# EAGLE design Internal_Breakout (EAGLE 9.0.0)
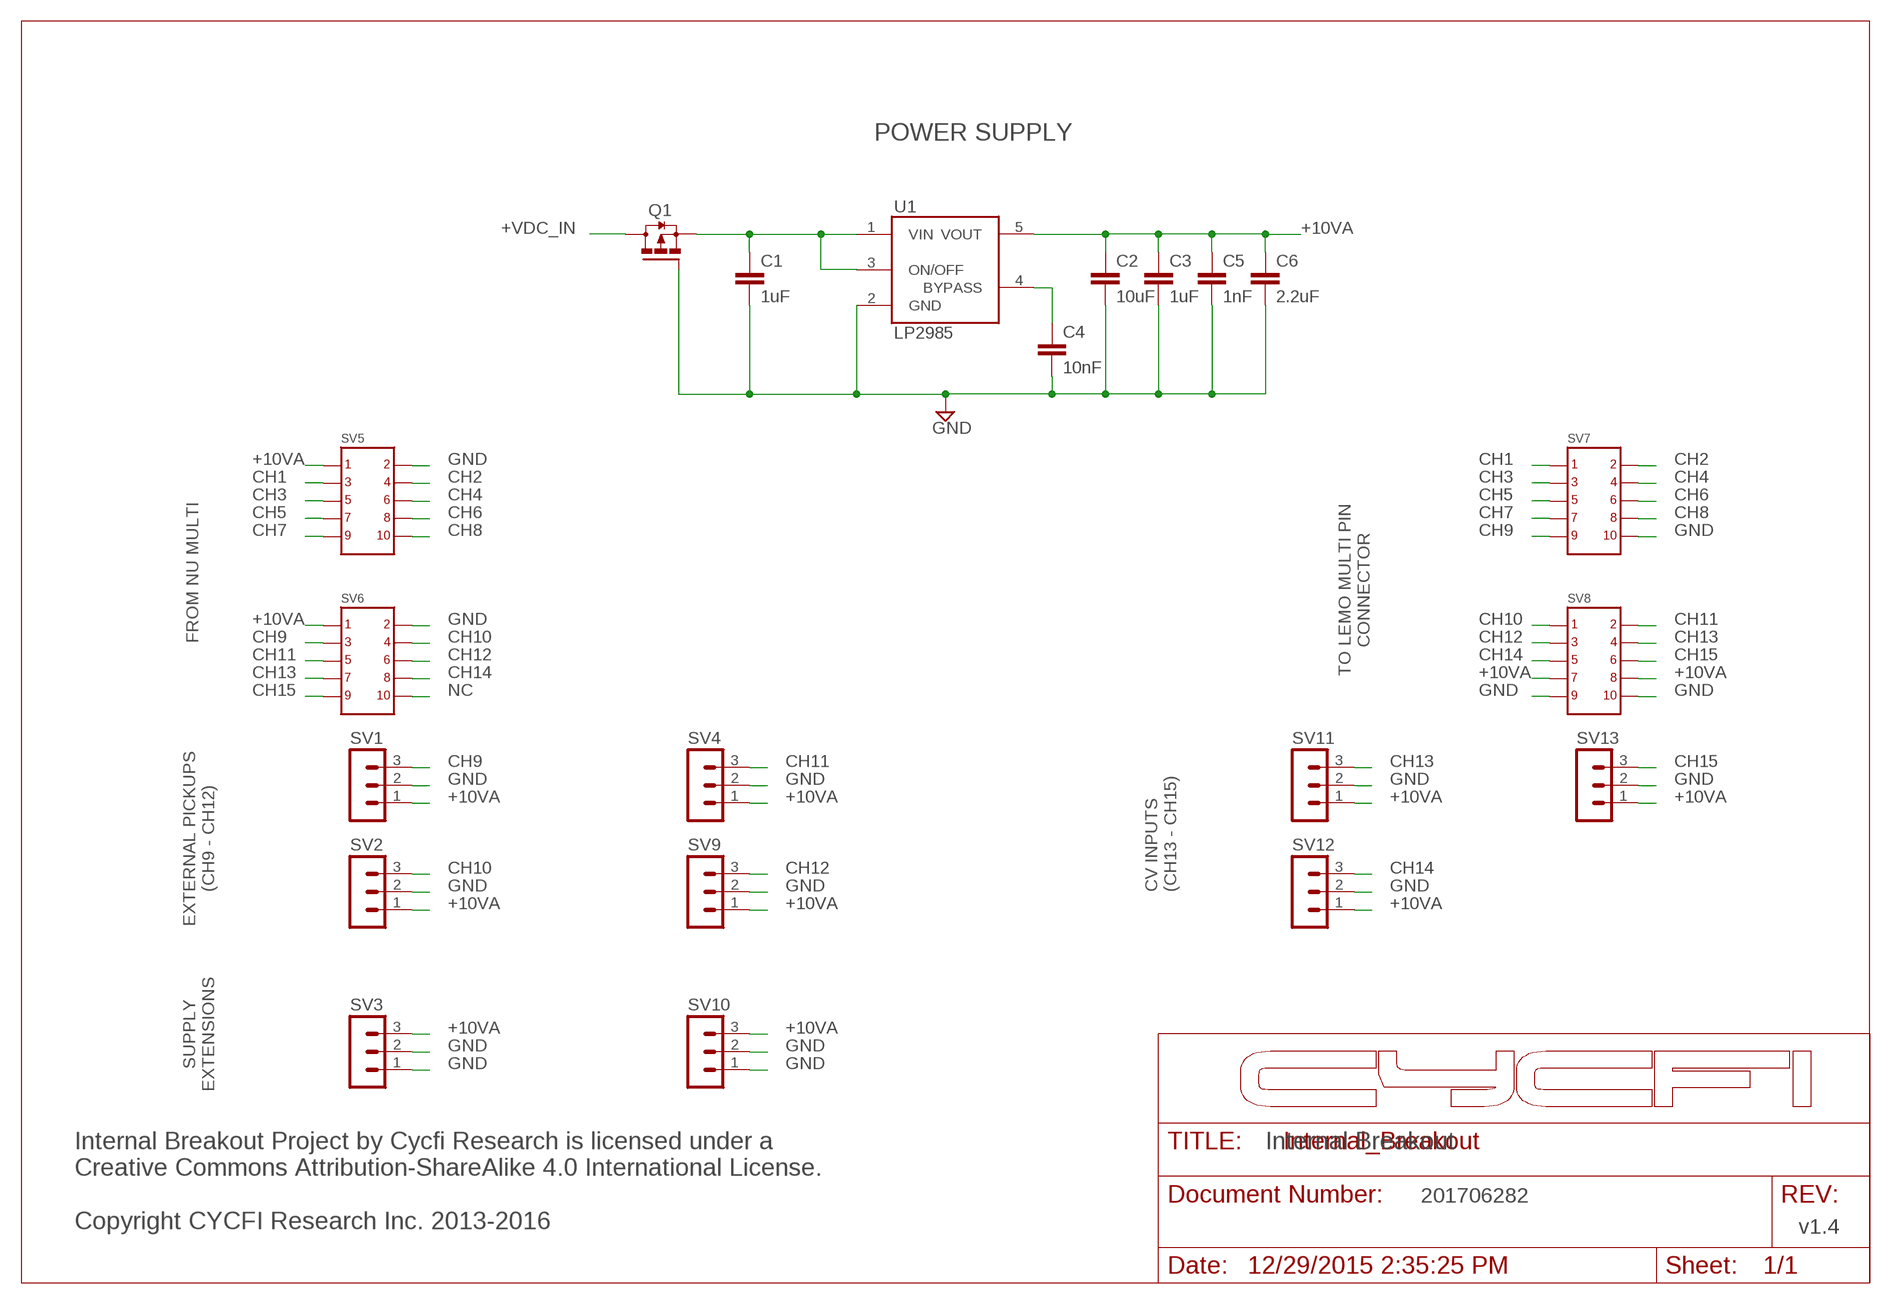
[diagram p0: schematic, sheet 1]

## Parts
C1  1uF  C-EUC0603  [C0603]
C2  10uF  C-EUC0603  [C0603]
C3  1uF  C-EUC0603  [C0603]
C4  10nF  C-EUC0402  [C0402]
C5  1nF  C-EUC0402  [C0402]
C6  2.2uF  C-EUC0603  [C0603]
Q1  DMP3099L  FDN360P  [SUPER-SOT3]
SV1  MA03-1  [MA03-1]
SV2  MA03-1  [MA03-1]
SV3  MA03-1  [MA03-1]
SV4  MA03-1  [MA03-1]
SV5  2X5  [2X5]
SV6  2X5  [2X5]
SV7  2X5  [2X5]
SV8  2X5  [2X5]
SV9  MA03-1  [MA03-1]
SV10  MA03-1  [MA03-1]
SV11  MA03-1  [MA03-1]
SV12  MA03-1  [MA03-1]
SV13  MA03-1  [MA03-1]
U1  LP2985  LP2985AIM5-3.3  [SOT25]

## Nets
+VDC_IN: Q1.3(D) SV8.7 SV8.8
BYPASS: C4.1 U1.4(BYPASS)
CH1: SV5.3 SV7.1
CH2: SV5.4 SV7.2
CH3: SV5.5 SV7.3
CH4: SV5.6 SV7.4
CH5: SV5.7 SV7.5
CH6: SV5.8 SV7.6
CH7: SV5.9 SV7.7
CH8: SV5.10 SV7.8
CH9: SV1.3 SV6.3 SV7.9
CH10: SV2.3 SV6.4 SV8.1
CH11: SV4.3 SV6.5 SV8.2
CH12: SV6.6 SV8.3 SV9.3
CH13: SV6.7 SV8.4 SV11.3
CH14: SV6.8 SV8.5 SV12.3
CH15: SV6.9 SV8.6 SV13.3
GND: C1.2 C2.2 C3.2 C4.2 C5.2 C6.2 Q1.1(G) SV1.2 SV2.2 SV3.1 SV3.2 SV4.2 SV5.2 SV6.2 SV7.10 SV8.9 SV8.10 SV9.2 SV10.1 SV10.2 SV11.2 SV12.2 SV13.2 U1.2(GND)
N$1: C1.1 Q1.2(S) U1.1(VIN) U1.3(ON/OFF)
N$2: SV6.10
V+: C2.1 C3.1 C5.1 C6.1 SV1.1 SV2.1 SV3.3 SV4.1 SV5.1 SV6.1 SV9.1 SV10.3 SV11.1 SV12.1 SV13.1 U1.5(VOUT)

## Notes on the sheet
- POWER SUPPLY
- +10VA
- +10VA | GND
- CH1 | CH2
- CH3 | CH4
- CH5 | CH6
- CH7 | CH8
- TO LEMO MULTI PIN
  CONNECTOR
- +10VA | GND
- FROM NU MULTI
- +10VA | +10VA
- NC
- +10VA | +10VA | +10VA | +10VA
- EXTERNAL PICKUPS
  (CH9 - CH12)
- CV INPUTS
  (CH13 - CH15)
- +10VA | +10VA | +10VA
- SUPPLY
  EXTENSIONS
- +10VA | +10VA
- Internal Breakout
- 201706282
- Internal Breakout Project by Cycfi Research is licensed under a 
  Creative Commons Attribution-ShareAlike 4.0 International License. 
  
  Copyright CYCFI Research Inc. 2013-2016
- v1.4
- 12/29/2015 2:35:25 PM

## Library data of the parts
C1-C6 = rcl:C-EU: CAPACITOR, European symbol; SPICEPREFIX: C
Q1 = transistor-power:FDN360P: Single P-Channel, PowerTrench (R) MOSFET Source: http://www.fairchildsemi.com/ds/FD/FDN360P.pdf
SV1-SV4 SV9-SV13 = con-lstb:MA03-1: PIN HEADER; OC_FARNELL: unknown; OC_NEWARK: unknown
SV5-SV8 = headers(2mm):2X5
U1 = LP2985:LP2985: LP2985-N Micropower 150 mA Low-Noise Ultra Low-Dropout Regulator

## Board
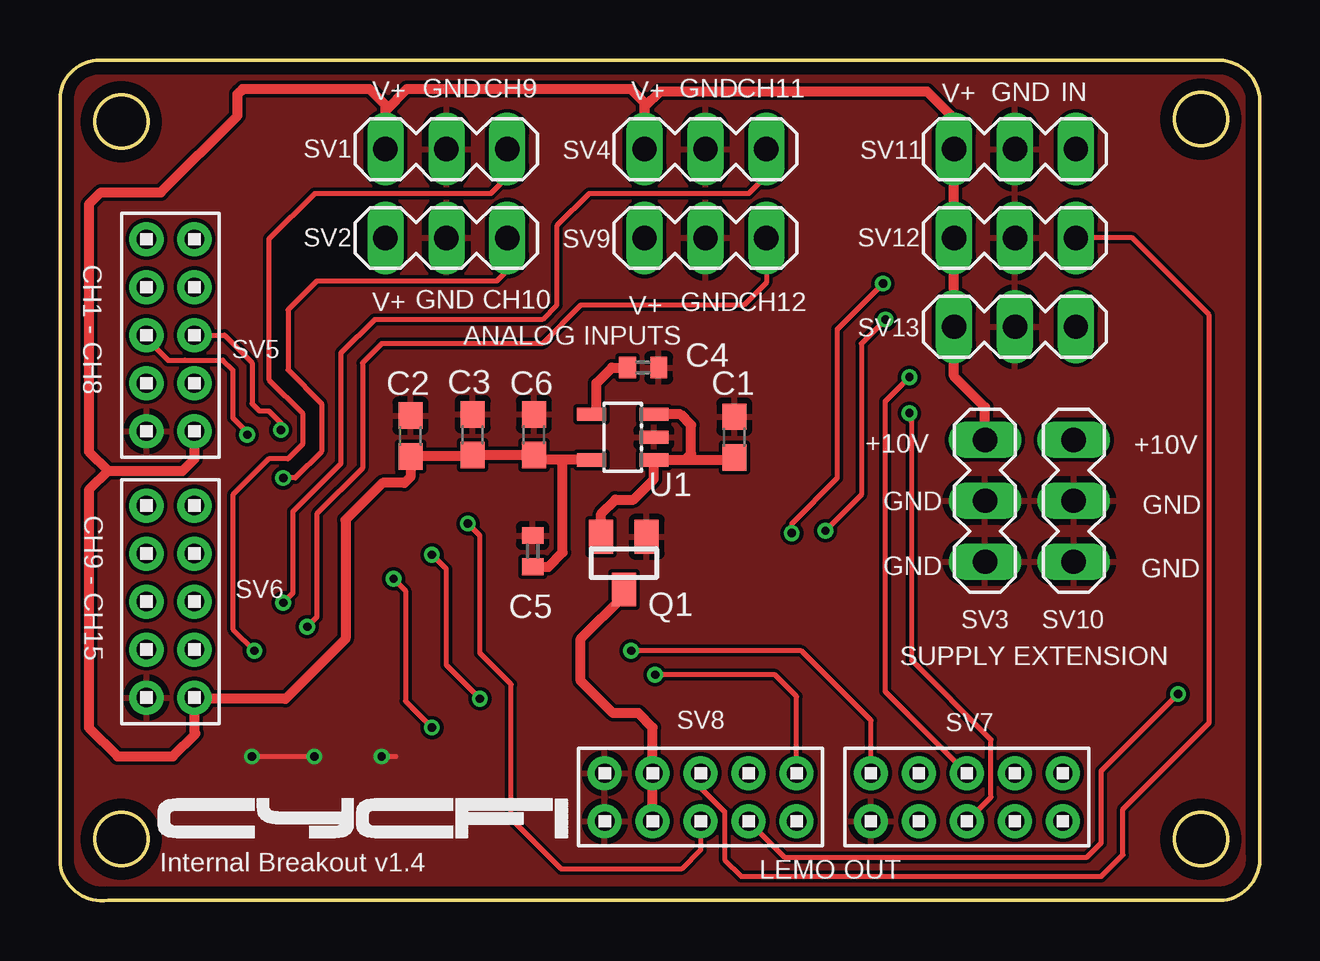
[diagram p1: board, top side]
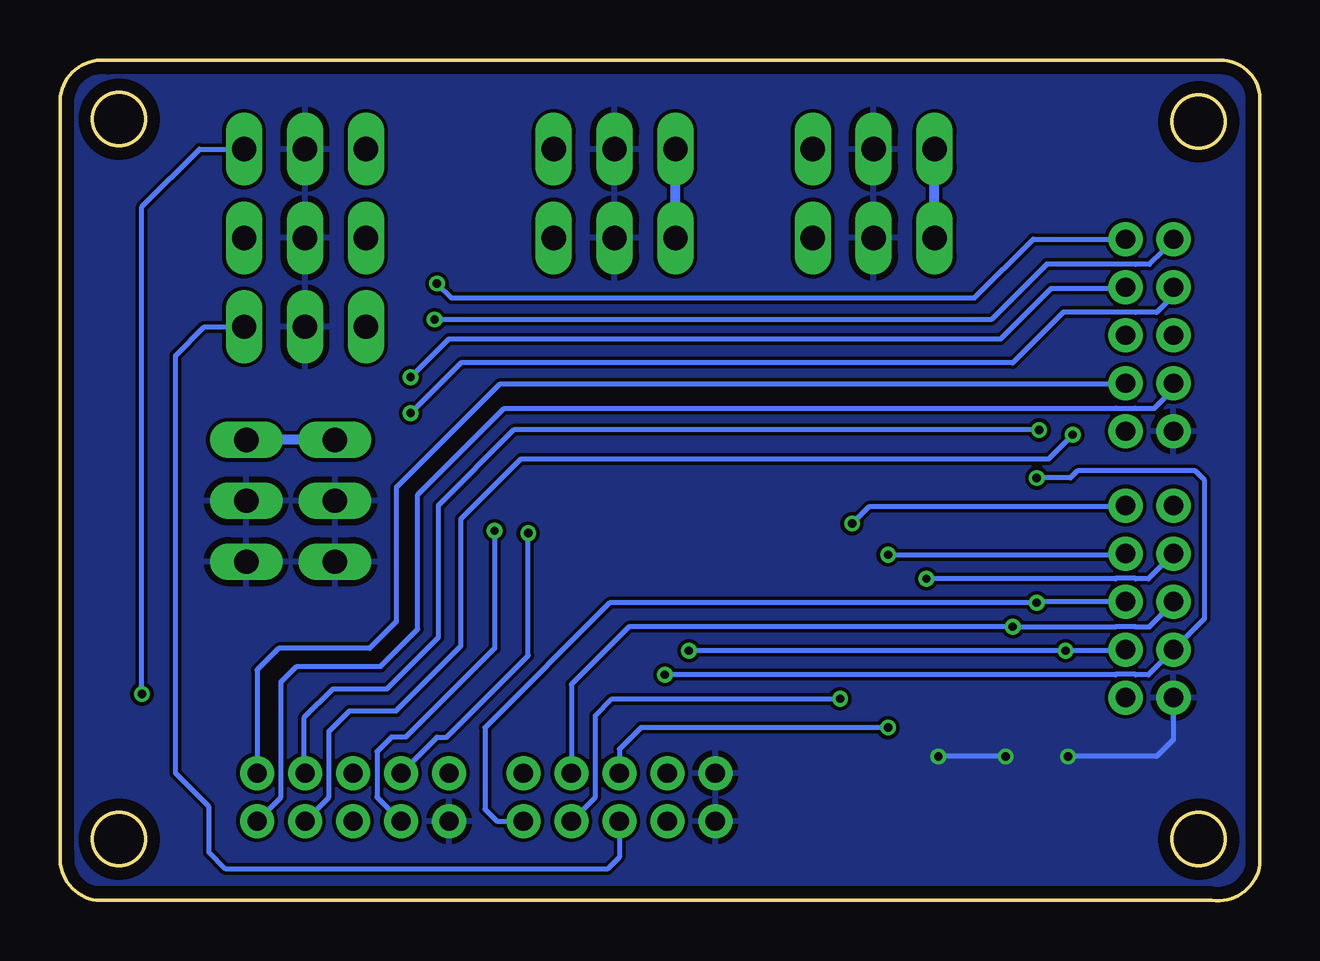
[diagram p2: board, bottom side, seen from below]

Size 50.02 x 35.03 mm. Coordinates in mm from the lower left corner, seen from the top.
Outline: 1.5,35.02 48,35.02 arc-90 50,33.52 50,2.02 arc-90 48.5,0.02 2,0.02 arc-90 0,1.52 0,33.27 arc-90 1.5,35.02
Outline: circle at 2.55,32.47 radius 1.1
Outline: circle at 2.55,2.57 radius 1.1
Outline: circle at 47.55,32.57 radius 1.1
Outline: circle at 47.55,2.57 radius 1.1
Copper layers (1*16): Top 0.035mm / dielectric 1.6mm / Bottom 0.035mm
Design rules "Elecrow_2-layer_PCB_eagle_rule": minimum track width 6mil, minimum drill 12mil, track to track 6mil, track to pad 6mil, pad to pad 6mil, via to via 8mil, smd to smd 0mil, copper to edge 20mil, drill to drill 10mil, minimum pad ring 6mil, minimum via ring 6mil, stop-mask expansion 0mil, vias tented up to drill 100mil, thermal gap 10mil

### Footprints (pad centres in the part's own frame; a part is rotated, then mirrored left to right if it is on the bottom)
C0603 = smd 1.1 x 1: 1 -0.85,0; 2 0.85,0
C0402 = smd 0.7 x 0.9: 1 -0.65,0; 2 0.65,0
SUPER-SOT3 = smd 1 x 1.4: 1 -0.95,-1.1; 2 0.95,-1.1; 3 0,1.1
MA03-1 = drill 1.016 long: 1 -2.54,0; 2 0,0; 3 2.54,0
2X5 = drill 0.8 pad 1.422: 1 -4,-1; 2 -4,1; 3 -2,-1; 4 -2,1; 5 0,-1; 6 0,1; 7 2,-1; 8 2,1; 9 4,-1; 10 4,1
SOT25 = smd 0.55 x 1.2: 1 -0.95,-1.3; 2 0,-1.3; 3 0.95,-1.3; 4 0.95,1.3; 5 -0.95,1.3

### Placement (x,y rotation side)
C1  28.1,19.32 90 top
C2  14.6,19.37 90 top
C3  17.2,19.42 90 top
C4  24.3,22.22 0 top
C5  19.7,14.57 90 top
C6  19.75,19.42 90 top
Q1  23.5,14.07 180 top
SV1  16.1,31.32 0 top
SV2  16.1,27.62 0 top
SV3  38.55,16.67 90 top
SV4  26.9,31.32 0 top
SV5  4.6,23.57 90 top
SV6  4.6,12.47 90 top
SV7  37.8,4.32 180 top
SV8  26.7,4.32 180 top
SV9  26.9,27.62 0 top
SV10  42.25,16.67 90 top
SV11  39.8,31.32 0 top
SV12  39.8,27.62 0 top
SV13  39.8,23.92 0 top
U1  23.45,19.32 90 top

### Tracks (layer width: path | path; a pad name or v marks a point on that pad's centre or on a via)
+VDC_IN
  Top 0.406: SV8.8 SV8.7 24.7,7.22 24.1,7.82 23.05,7.82 21.7,9.17 21.7,10.92 23.5,12.72 Q1.3
BYPASS
  Top 0.406: U1.4 22.35,20.47 22.35,21.57 23,22.22 C4.1
CH1
  Bottom 0.203: SV5.3 5.65,21.52 31.7,21.52 36,17.22 36,11.62 37.1,10.52 40.9,10.52 41.8,9.62 SV7.1
CH2
  Bottom 0.203: SV7.2 40.8,4.32 40.8,9.12 40.15,9.77 36.65,9.77 35.1,11.32 35.1,16.92 31.5,20.52 6.02,20.52 6,20.53 5.2,20.53 5.19,20.52 4.4,20.52 3.6,21.32 SV5.4
CH3  (via drill 0.35)
  Top 0.203: SV5.5 6.85,23.57 8,22.42 8,20.72 8.3,20.42 8.7,20.42 9.2,19.92 v9.2,19.62
  Bottom 0.203: v9.2,19.62 31.1,19.62 34.25,16.47 34.25,10.97 36.4,8.82 38.65,8.82 39.85,7.62 39.85,5.37 SV7.3
CH4  (via drill 0.35)
  Top 0.203: SV5.6 3.6,23.42 4.5,22.52 5.19,22.52 5.2,22.53 6.79,22.53 7.2,22.12 7.2,20.12 7.8,19.52 v7.8,19.42
  Bottom 0.203: SV7.4 38.8,4.32 38.8,7.07 37.95,7.92 36,7.92 33.3,10.62 33.3,15.92 30.8,18.42 8.8,18.42 v7.8,19.42
CH5  (via drill 0.35)
  Top 0.203: SV7.5 34.4,8.72 34.4,20.82 v35.4,21.82
  Bottom 0.203: v35.4,21.82 33.8,23.42 10.8,23.42 8.7,25.52 5.65,25.52 SV5.7
CH6  (via drill 0.35)
  Top 0.203: SV7.6 38.8,4.32 38.8,6.72 35.5,10.02 35.5,19.97 35.4,20.07 v35.4,20.32
  Bottom 0.203: SV5.8 3.6,25.22 4.3,24.52 5.19,24.52 5.2,24.53 8.19,24.53 10.3,22.42 33.3,22.42 v35.4,20.32
CH7  (via drill 0.35)
  Top 0.203: v30.5,15.32 30.5,15.72 32.4,17.62 32.4,23.82 v34.3,25.72
  Bottom 0.203: SV7.7 34.3,6.82 33.9,6.82 30.5,10.22 v30.5,15.32 | v34.3,25.72 33.7,25.12 11.9,25.12 9.45,27.57 SV5.9
CH8  (via drill 0.35)
  Top 0.203: v34.4,24.22 33.4,23.22 33.4,16.92 v31.9,15.42
  Bottom 0.203: SV5.10 4.05,27.12 4.05,27.07 4.6,26.52 5.19,26.52 5.2,26.53 8.89,26.53 11.2,24.22 v34.4,24.22 | v31.9,15.42 31.9,10.52 35.6,6.82 36.2,6.82 36.8,6.22 36.8,4.32 SV7.8
CH9  (via drill 0.35)
  Top 0.203: SV7.9 33.8,7.52 30.9,10.42 v23.8,10.42 | SV1.3 18.64,30.16 17.95,29.47 10.6,29.47 8.7,27.57 8.7,21.72 10.1,20.32 10.1,19.02 9.5,18.42 8.7,18.42 7.2,16.92 7.2,11.32 v8.1,10.42
  Bottom 0.203: SV6.3 5.65,10.42 v8.1,10.42 v23.8,10.42
CH10  (via drill 0.35)
  Top 0.203: SV8.1 30.7,8.52 29.8,9.42 v24.8,9.42 | SV2.3 18.64,26.26 18.2,25.82 10.7,25.82 9.5,24.62 9.5,22.12 10.9,20.72 10.9,18.72 9.8,17.62 v9.3,17.62
  Bottom 0.203: v24.8,9.42 6.02,9.42 6,9.43 5.2,9.43 5.19,9.42 4.65,9.42 SV6.4 2.3,11.77 2.3,17.52 2.7,17.92 7.6,17.92 7.9,17.62 v9.3,17.62
CH11  (via drill 0.35)
  Top 0.203: SV4.3 29.44,30.21 28.7,29.47 22.05,29.47 20.7,28.12 20.7,24.82 20.1,24.22 13.1,24.22 11.7,22.82 11.7,18.22 9.7,16.22 9.7,12.82 v9.3,12.42
  Bottom 0.203: SV6.5 9.25,12.47 v9.3,12.42 27.1,12.42 32.3,7.22 32.3,3.82 31.8,3.32 SV8.2
CH12  (via drill 0.35)
  Top 0.203: SV9.3 29.44,25.76 28.5,24.82 21.7,24.82 20.1,23.22 13.4,23.22 12.6,22.42 12.6,18.02 10.7,16.12 10.7,11.82 v10.3,11.42
  Bottom 0.203: SV6.6 3.6,12.42 4.6,11.42 5.19,11.42 5.2,11.43 6,11.43 6.02,11.42 v10.3,11.42 26.3,11.42 28.7,9.02 SV8.3
CH13  (via drill 0.35)
  Top 0.203: SV8.4 30.2,1.82 42.8,1.82 43.4,2.42 43.4,5.42 v46.6,8.62 | v17.5,8.42 16.1,9.82 16.1,13.82 v15.5,14.42
  Bottom 0.203: SV8.4 27.7,4.32 27.7,7.72 27,8.42 v17.5,8.42 | v15.5,14.42 5.65,14.42 SV6.7 | SV11.3 44.2,31.32 46.6,28.92 v46.6,8.62
CH14  (via drill 0.35)
  Top 0.203: SV8.5 26.7,4.72 27.7,3.72 27.7,1.72 28.4,1.02 43.4,1.02 44.3,1.92 44.3,3.82 47.9,7.42 47.9,24.42 44.7,27.62 SV12.3 | v13.9,13.42 14.4,12.92 14.4,8.32 v15.5,7.22
  Bottom 0.203: SV6.8 4.65,13.42 5.19,13.42 5.2,13.43 6,13.43 6.02,13.42 v13.9,13.42 | v15.5,7.22 25.8,7.22 26.7,6.32 SV8.5
CH15  (via drill 0.35)
  Top 0.203: SV8.6 26.7,2.12 25.9,1.32 20.9,1.32 18.8,3.42 18.8,9.02 17.5,10.32 17.5,15.22 v17,15.72
  Bottom 0.203: SV6.9 5.65,16.42 16.3,16.42 v17,15.72 | SV8.6 26.7,1.82 27.2,1.32 43.1,1.32 43.8,2.02 43.8,3.92 45.2,5.32 45.2,22.72 44,23.92 SV13.3
GND  (via drill 0.35)
  Top 0.203: v13.4,6.02 14,6.02 | v8,6.02 v10.6,6.02
  Bottom 0.203: SV6.2 3.6,6.72 4.3,6.02 v8,6.02 | v10.6,6.02 v13.4,6.02
  pour Top: 0,2.02 0,34.97 0,35.02 2.2,35.02 50.05,35.02 50.05,33.17 50,33.12 50,0.07 50,0.02 47.3,0.02 -0.05,0.02 -0.05,1.97
  pour Bottom: 0,0.02 0,2.07 0,35.02 50.05,35.02 50.05,32.77 50.05,0.07 50.05,0.02 48.1,0.02
N$1
  Top 0.406: Q1.2 22.55,16.12 23.15,16.72 23.9,16.72 24.75,17.57 U1.1 26.05,18.37 | U1.3 25.85,20.27 26.3,19.82 26.3,18.62 26.05,18.37 | 26.05,18.37 28,18.37 C1.1
V+
  Top 0.406: SV3.3 38.55,20.57 37.26,21.86 SV13.1 SV12.1 SV11.1 37.26,32.61 36.15,33.72 25,33.72 24.36,33.08 SV4.1 24.36,33.26 23.8,33.82 14.45,33.82 13.56,32.93 SV1.1 13.56,33.16 12.9,33.82 7.6,33.82 7.4,33.62 7.4,32.72 4.2,29.52 1.7,29.52 1.2,29.02 1.2,18.72 2,17.92 | 2,17.92 5.1,17.92 5.6,18.42 SV5.1 | 2,17.92 1.2,17.12 1.2,7.22 2.4,6.02 4.7,6.02 5.65,6.97 5.6,7.02 5.6,8.32 | 5.6,8.32 SV6.1 | U1.5 20.95,18.37 | 20.95,18.37 19.95,18.37 C6.1 C3.1 17.15,18.52 C2.1 14.6,17.67 14.35,17.42 13.45,17.42 11.9,15.87 11.9,10.92 9.4,8.42 5.7,8.42 5.6,8.32 | C5.1 20.35,13.92 20.95,14.52 20.95,18.37
  Bottom 0.406: SV2.1 SV1.1 | SV9.1 SV4.1 | SV3.3 SV10.3

### Text on the board
tNames: V+ | GND | CH9 | V+ | GND | CH11 | V+ | GND | IN | CH1 - CH8 | V+ | GND | CH10 | GND | CH12 | V+ | SV5 | ANALOG INPUTS | +10V | +10V | CH9 - CH15 | GND | GND | GND | SV6 | GND | SUPPLY EXTENSION | SV8 | SV7 | Internal Breakout v1.4 | LEMO OUT